# EAGLE design 6502exp (EAGLE 6.6.0)
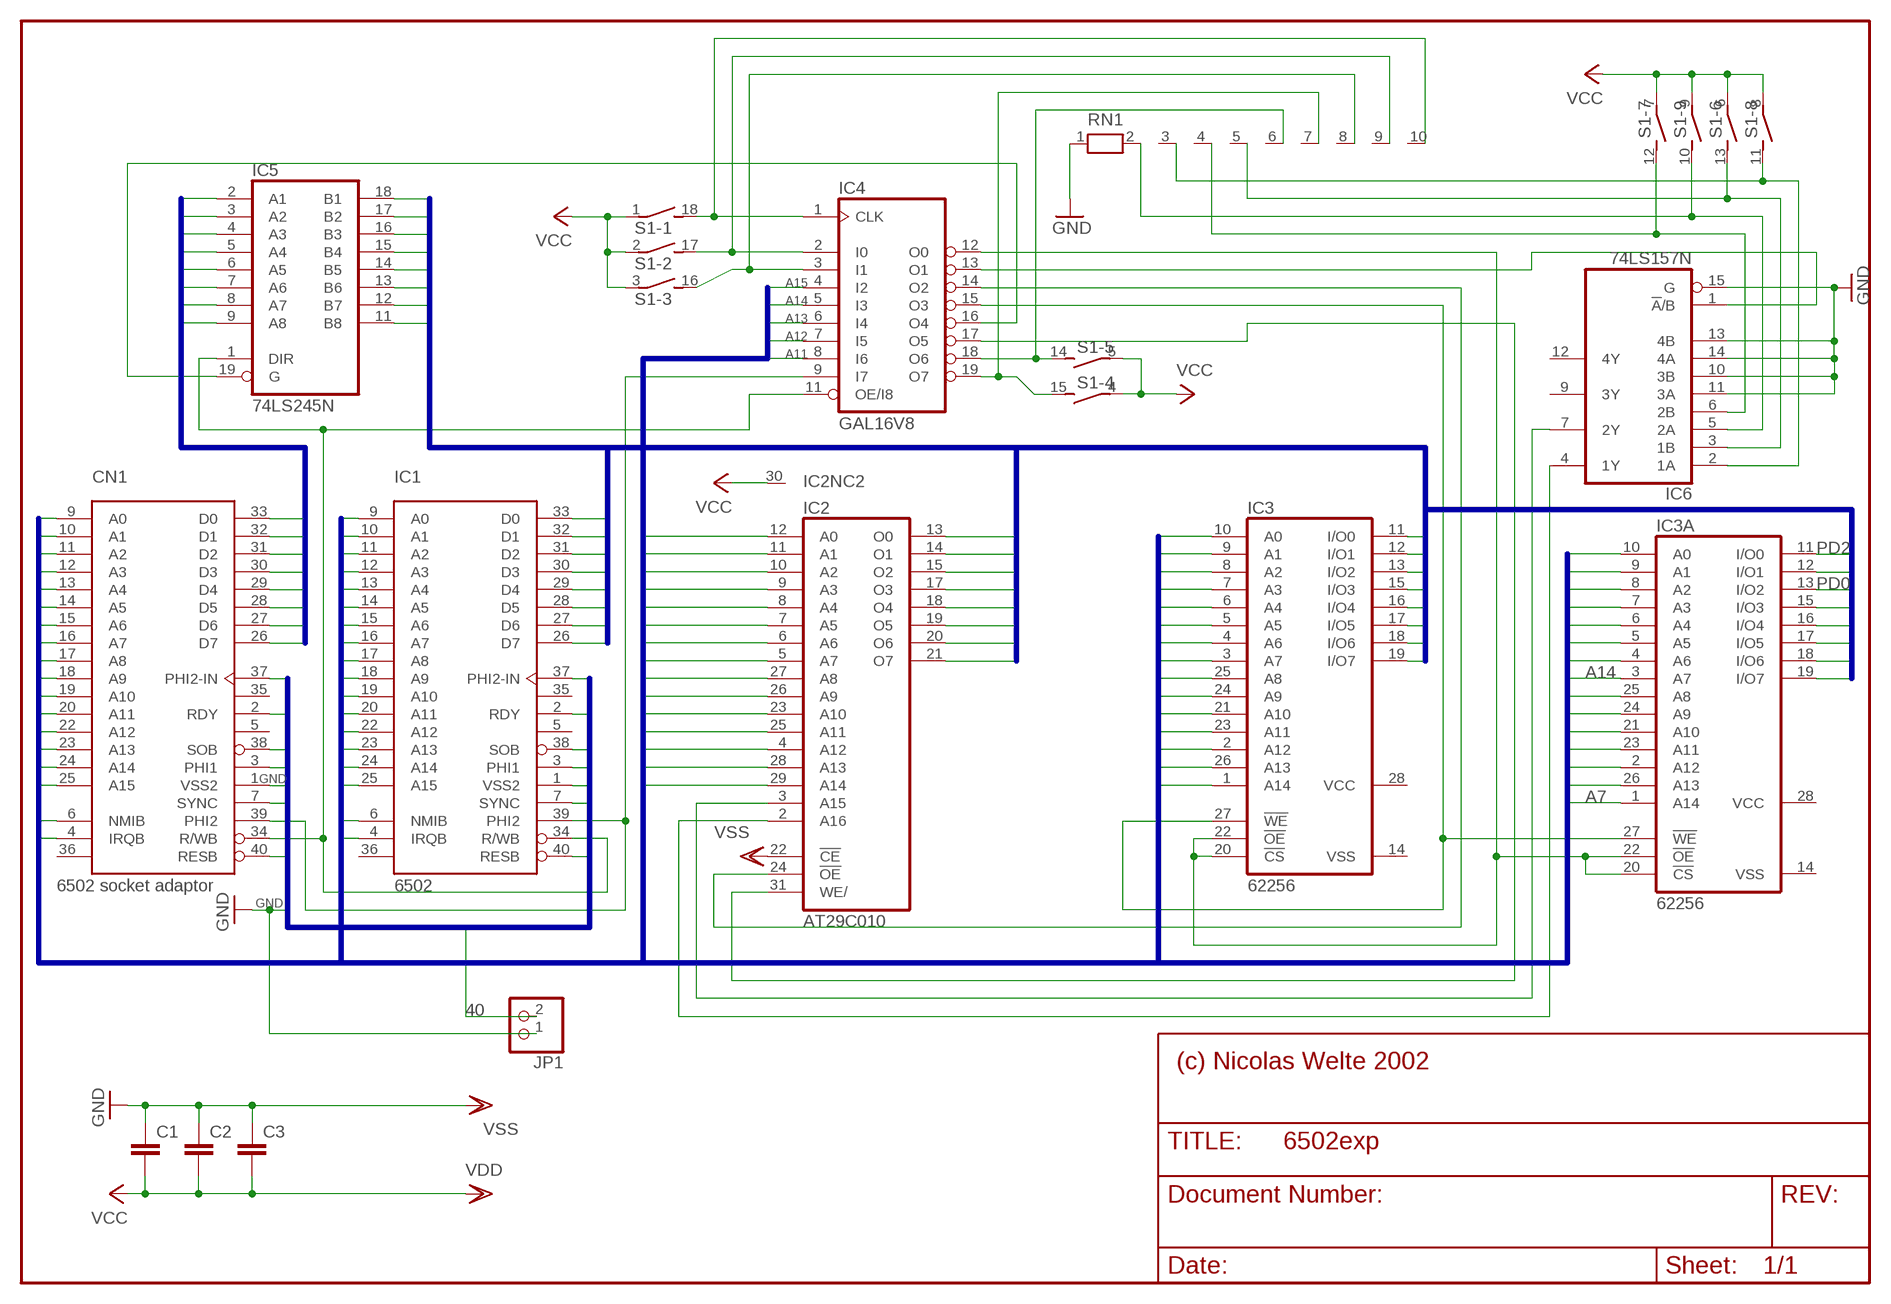
[diagram p0: schematic, sheet 1]

## Parts
C1  C5/3  [C5B3]
C2  C5/3  [C5B3]
C3  C5/3  [C5B3]
CN1  6502 socket adaptor  G65SC02P  [DIP-40]
IC1  6502  G65SC02P  [DIP-40]
IC2  AT29C010  AM29F010P  [DIL32-3]
IC3  62256  62256P  [DIL28-6]
IC3A  62256  62256FP  [SO28L]
IC4  GAL16V8  16V8  [DIL20]
IC5  74LS245N  [DIL20]
IC6  74LS157N  [DIL16]
JP1  PINHD-1X2  [1X02]
RN1  RN09  [RN-10]
S1  DS09E  [DS-09]

## Nets
2: CN1.2(RDY) IC1.2(RDY)
3: CN1.3(PHI1) IC1.3(PHI1)
7: CN1.7(SYNC) IC1.7(SYNC)
37: CN1.37(PHI2-IN) IC1.37(PHI2-IN)
38: CN1.38(SOB) IC1.38(SOB)
40: CN1.40(RESB) IC1.40(RESB) JP1.2
A0: CN1.9(A0) IC1.9(A0) IC2.12(A0) IC3.10(A0) IC3A.10(A0)
A1: CN1.10(A1) IC1.10(A1) IC2.11(A1) IC3.9(A1) IC3A.9(A1)
A2: CN1.11(A2) IC1.11(A2) IC2.10(A2) IC3.8(A2) IC3A.8(A2)
A3: CN1.12(A3) IC1.12(A3) IC2.9(A3) IC3.7(A3) IC3A.7(A3)
A4: CN1.13(A4) IC1.13(A4) IC2.8(A4) IC3.6(A4) IC3A.6(A4)
A5: CN1.14(A5) IC1.14(A5) IC2.7(A5) IC3.5(A5) IC3A.5(A5)
A6: CN1.15(A6) IC1.15(A6) IC2.6(A6) IC3.4(A6) IC3A.4(A6)
A7: CN1.16(A7) IC1.16(A7) IC2.5(A7) IC3.3(A7) IC3A.1(A14)
A8: CN1.17(A8) IC1.17(A8) IC2.27(A8) IC3.25(A8) IC3A.25(A8)
A9: CN1.18(A9) IC1.18(A9) IC2.26(A9) IC3.24(A9) IC3A.24(A9)
A10: CN1.19(A10) IC1.19(A10) IC2.23(A10) IC3.21(A10) IC3A.21(A10)
A11: CN1.20(A11) IC1.20(A11) IC2.25(A11) IC3.23(A11) IC3A.23(A11) IC4.8(I6)
A12: CN1.22(A12) IC1.22(A12) IC2.4(A12) IC3.2(A12) IC3A.2(A12) IC4.7(I5)
A13: CN1.23(A13) IC1.23(A13) IC2.28(A13) IC3.26(A13) IC3A.26(A13) IC4.6(I4)
A14: CN1.24(A14) IC1.24(A14) IC2.29(A14) IC3.1(A14) IC3A.3(A7) IC4.5(I3)
A15: CN1.25(A15) IC1.25(A15) IC4.4(I2)
D0: CN1.33(D0) IC5.2(A1)
D1: CN1.32(D1) IC5.3(A2)
D2: CN1.31(D2) IC5.4(A3)
D3: CN1.30(D3) IC5.5(A4)
D4: CN1.29(D4) IC5.6(A5)
D5: CN1.28(D5) IC5.7(A6)
D6: CN1.27(D6) IC5.8(A7)
D7: CN1.26(D7) IC5.9(A8)
GND: C1.1 C2.1 C3.1 CN1.1(VSS2) IC1.1(VSS2) IC2.22(!CE) IC6.10(3B) IC6.11(3A) IC6.13(4B) IC6.14(4A) IC6.15(G) JP1.1 RN1.1 ; supply symbol labelled VSS
IRQ: CN1.4(IRQB) IC1.4(IRQB)
N$1: CN1.34(R/WB) IC1.34(R/WB) IC4.11(OE/I8) IC5.1(DIR)
N$2: IC4.3(I1) RN1.8 S1.16
N$3: CN1.39(PHI2) IC1.39(PHI2) IC4.9(I7)
N$4: IC4.2(I0) RN1.9 S1.17
N$5: IC4.1(CLK) RN1.10 S1.18
N$6: IC4.18(O6) RN1.6 S1.14
N$7: IC4.19(O7) RN1.7 S1.15
N$8: IC4.16(O4) IC5.19(G)
N$9: IC3.27(!WE) IC3A.27(!WE) IC4.15(O3)
N$10: IC2.24(!OE) IC4.14(O2)
N$11: IC2.31(WE/) IC4.17(O5)
N$12: IC4.13(O1) IC6.1(!A!/B)
N$13: IC2.3(A15) IC6.7(2Y)
N$14: IC3.20(!CS) IC3.22(!OE) IC3A.20(!CS) IC3A.22(!OE) IC4.12(O0)
N$15: IC2.2(A16) IC6.4(1Y)
N$16: IC6.2(1A) RN1.3 S1.11
N$17: IC6.3(1B) RN1.5 S1.13
N$18: IC6.5(2A) RN1.2 S1.10
N$19: IC6.6(2B) RN1.4 S1.12
NMI: CN1.6(NMIB) IC1.6(NMIB)
PD0: IC1.33(D0) IC2.13(O0) IC3.11(I/O0) IC3A.13(I/O2) IC5.18(B1)
PD1: IC1.32(D1) IC2.14(O1) IC3.12(I/O1) IC3A.12(I/O1) IC5.17(B2)
PD2: IC1.31(D2) IC2.15(O2) IC3.13(I/O2) IC3A.11(I/O0) IC5.16(B3)
PD3: IC1.30(D3) IC2.17(O3) IC3.15(I/O3) IC3A.15(I/O3) IC5.15(B4)
PD4: IC1.29(D4) IC2.18(O4) IC3.16(I/O4) IC3A.16(I/O4) IC5.14(B5)
PD5: IC1.28(D5) IC2.19(O5) IC3.17(I/O5) IC3A.17(I/O5) IC5.13(B6)
PD6: IC1.27(D6) IC2.20(O6) IC3.18(I/O6) IC3A.18(I/O6) IC5.12(B7)
PD7: IC1.26(D7) IC2.21(O7) IC3.19(I/O7) IC3A.19(I/O7) IC5.11(B8)
VCC: C1.2 C2.2 C3.2 IC2.30(NC) S1.1 S1.2 S1.3 S1.4 S1.5 S1.6 S1.7 S1.8 S1.9 ; supply symbol labelled VDD
Unconnected: CN1.5(NC$3) CN1.35(NC$1) CN1.36(NC$2) IC1.5(NC$3) IC1.35(NC$1) IC1.36(NC$2) IC2.1(NC) IC6.9(3Y) IC6.12(4Y)

## Buses
D[0..7]
PD[0..7]
A[0..15],NMI,IRQ
37,2,38,3,1,7,40

## Notes on the sheet
- (c) Nicolas Welte 2002

## Power pins joined to a net without a drawn wire
GND: CN1.21(VSS) IC1.21(VSS) IC2.16(GND) IC3.14(VSS) IC3A.14(VSS) IC4.10(GND) IC5.10(GND) IC6.8(GND)
VCC: CN1.8(VDD) IC1.8(VDD) IC2.32(VCC) IC3.28(VCC) IC3A.28(VCC) IC4.20(VCC) IC5.20(VCC) IC6.16(VCC)

## Library data of the parts
C1-C3 = capacitor-wima:C: CAPACITOR naming: grid - package width
CN1 IC1 = 65XXX:G65SC02P
IC2 = am29-memory:AM29F010*: 1-Megabit FLASH MEMORY (128 K x 8 bit) 5 V-only
IC3 = memory-hitachi:62256P: MEMORY
IC3A = memory-hitachi:62256FP: MEMORY
IC4 = pal:16V8: PAL
IC5 = 74xx-eu:74*245: Octal BUS TRANSCEIVER, 3-state
IC6 = 74xx-eu:74*157: Quadruple 2-line to 1-line data SELECTOR/MULTIPLEXER
JP1 = pinhead:PINHD-1X2: PIN HEADER
RN1 = resistor-net:RN09: RESISTOR NETWORK
S1 = switch-dil:DS09E: DIL/CODE SWITCH

## Board
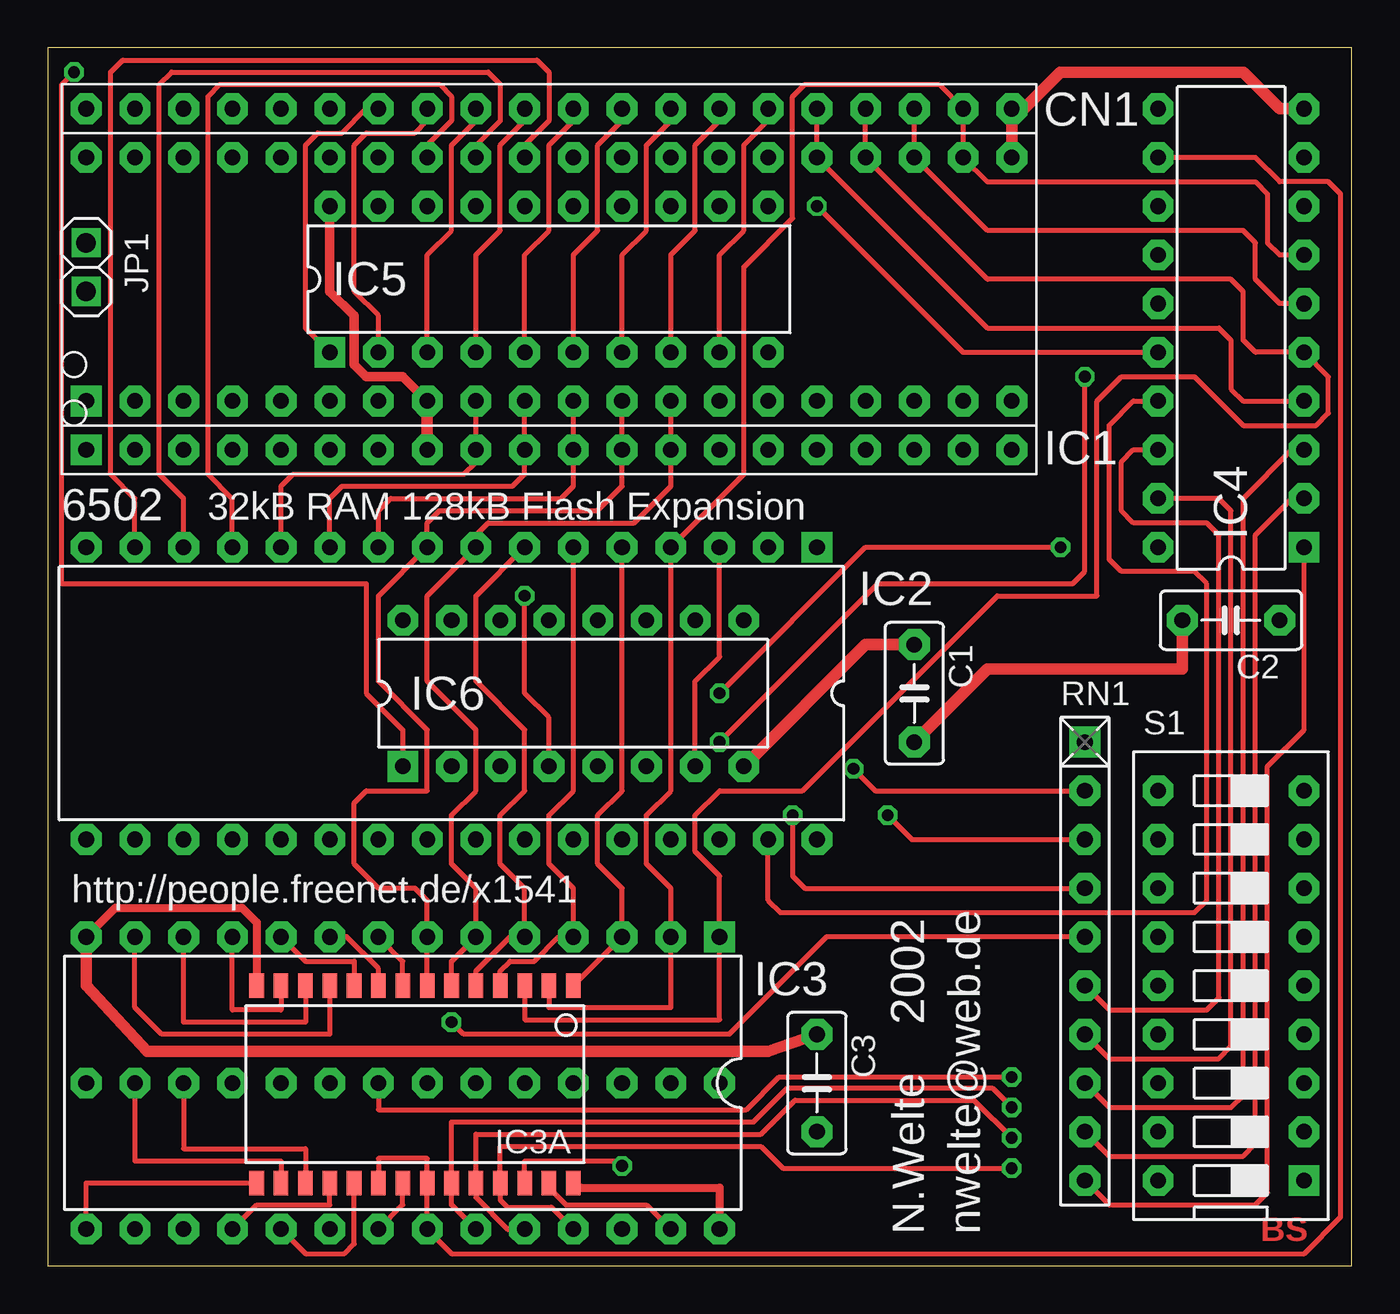
[diagram p1: board, top side]
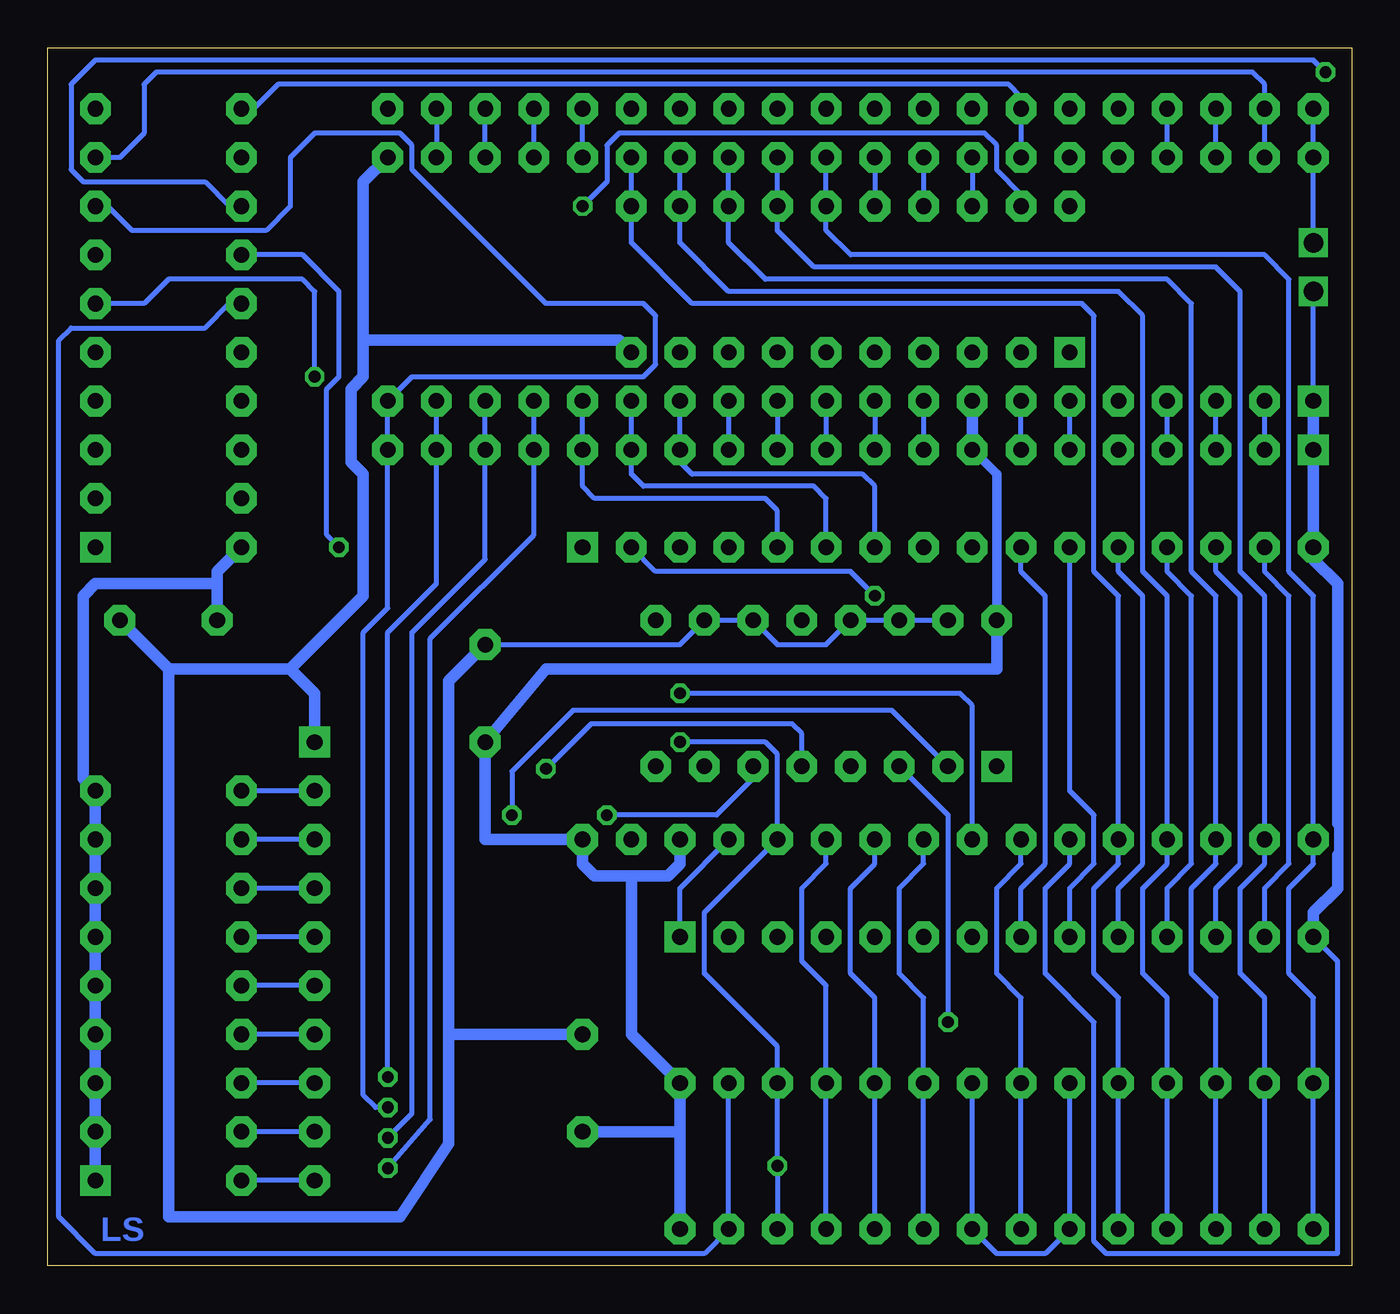
[diagram p2: board, bottom side, seen from below]

Size 67.97 x 63.49 mm. Coordinates in mm from the lower left corner, seen from the top.
Outline: 0,0 67.97,0 67.97,63.49 0,63.49 0,0
Copper layers (1*16): Top 0.035mm / dielectric 1.5mm / Bottom 0.035mm
Design rules "default *": minimum track width 10mil, minimum drill 24mil, track to track 8mil, track to pad 8mil, pad to pad 8mil, via to via 8mil, smd to smd 8mil, copper to edge 0.4mm, drill to drill 8mil, minimum pad ring 10mil, minimum via ring 8mil, stop-mask expansion 4mil, vias tented up to drill 0mil, thermal gap 10mil

### Footprints (pad centres in the part's own frame; a part is rotated, then mirrored left to right if it is on the bottom)
C5B3 = drill 0.813 pad 1.6 octagon: 1 -2.54,0; 2 2.54,0
DIP-40 = drill 0.813 pad 1.6 square: 1 -22.86,-7.62 | drill 0.813 pad 1.6 octagon: 2 -20.32,-7.62; 3 -17.78,-7.62; 4 -15.24,-7.62; 5 -12.7,-7.62; 6 -10.16,-7.62; 7 -7.62,-7.62; 8 -5.08,-7.62; 9 -2.54,-7.62; 10 0,-7.62; 11 2.54,-7.62; 12 5.08,-7.62; 13 7.62,-7.62; 14 10.16,-7.62; 15 12.7,-7.62; 16 15.24,-7.62; 17 17.78,-7.62; 18 20.32,-7.62; 19 22.86,-7.62; 20 25.4,-7.62; 21 25.4,7.62; 22 22.86,7.62; 23 20.32,7.62; 24 17.78,7.62; 25 15.24,7.62; 26 12.7,7.62; 27 10.16,7.62; 28 7.62,7.62; 29 5.08,7.62; 30 2.54,7.62; 31 0,7.62; 32 -2.54,7.62; 33 -5.08,7.62; 34 -7.62,7.62; 35 -10.16,7.62; 36 -12.7,7.62; 37 -15.24,7.62; 38 -17.78,7.62; 39 -20.32,7.62; 40 -22.86,7.62
DIL32-3 = drill 0.813 pad 1.6 square: 1 -19.05,-3.81 | drill 0.813 pad 1.6 octagon: 2 -16.51,-3.81; 3 -13.97,-3.81; 4 -11.43,-3.81; 5 -8.89,-3.81; 6 -6.35,-3.81; 7 -3.81,-3.81; 8 -1.27,-3.81; 9 1.27,-3.81; 10 3.81,-3.81; 11 6.35,-3.81; 12 8.89,-3.81; 13 11.43,-3.81; 14 13.97,-3.81; 15 16.51,-3.81; 16 19.05,-3.81; 17 19.05,11.43; 18 16.51,11.43; 19 13.97,11.43; 20 11.43,11.43; 21 8.89,11.43; 22 6.35,11.43; 23 3.81,11.43; 24 1.27,11.43; 25 -1.27,11.43; 26 -3.81,11.43; 27 -6.35,11.43; 28 -8.89,11.43; 29 -11.43,11.43; 30 -13.97,11.43; 31 -16.51,11.43; 32 -19.05,11.43
DIL28-6 = drill 0.813 pad 1.6 square: 1 -16.51,-7.62 | drill 0.813 pad 1.6 octagon: 2 -13.97,-7.62; 3 -11.43,-7.62; 4 -8.89,-7.62; 5 -6.35,-7.62; 6 -3.81,-7.62; 7 -1.27,-7.62; 8 1.27,-7.62; 9 3.81,-7.62; 10 6.35,-7.62; 11 8.89,-7.62; 12 11.43,-7.62; 13 13.97,-7.62; 14 16.51,-7.62; 15 16.51,7.62; 16 13.97,7.62; 17 11.43,7.62; 18 8.89,7.62; 19 6.35,7.62; 20 3.81,7.62; 21 1.27,7.62; 22 -1.27,7.62; 23 -3.81,7.62; 24 -6.35,7.62; 25 -8.89,7.62; 26 -11.43,7.62; 27 -13.97,7.62; 28 -16.51,7.62
SO28L = smd 0.762 x 1.27: 1 -7.62,-5.207; 2 -6.35,-5.207; 3 -5.08,-5.207; 4 -3.81,-5.207; 5 -2.54,-5.207; 6 -1.27,-5.207; 7 0,-5.207; 8 1.27,-5.207; 9 2.54,-5.207; 10 3.81,-5.207; 11 5.08,-5.207; 12 6.35,-5.207; 13 7.62,-5.207; 14 8.89,-5.207; 15 8.89,5.08; 16 7.62,5.08; 17 6.35,5.08; 18 5.08,5.08; 19 3.81,5.08; 20 2.54,5.08; 21 1.27,5.08; 22 0,5.08; 23 -1.27,5.08; 24 -2.54,5.08; 25 -3.81,5.08; 26 -5.08,5.08; 27 -6.35,5.08; 28 -7.62,5.08
DIL20 = drill 0.813 pad 1.6 square: 1 -11.43,-3.81 | drill 0.813 pad 1.6 octagon: 2 -8.89,-3.81; 3 -6.35,-3.81; 4 -3.81,-3.81; 5 -1.27,-3.81; 6 1.27,-3.81; 7 3.81,-3.81; 8 6.35,-3.81; 9 8.89,-3.81; 10 11.43,-3.81; 11 11.43,3.81; 12 8.89,3.81; 13 6.35,3.81; 14 3.81,3.81; 15 1.27,3.81; 16 -1.27,3.81; 17 -3.81,3.81; 18 -6.35,3.81; 19 -8.89,3.81; 20 -11.43,3.81
DIL16 = drill 0.813 pad 1.6 square: 1 -8.89,-3.81 | drill 0.813 pad 1.6 octagon: 2 -6.35,-3.81; 3 -3.81,-3.81; 4 -1.27,-3.81; 5 1.27,-3.81; 6 3.81,-3.81; 7 6.35,-3.81; 8 8.89,-3.81; 9 8.89,3.81; 10 6.35,3.81; 11 3.81,3.81; 12 1.27,3.81; 13 -1.27,3.81; 14 -3.81,3.81; 15 -6.35,3.81; 16 -8.89,3.81
1X02 = drill 1.016 square: 1 -1.27,0; 2 1.27,0
RN-10 = drill 0.813 pad 1.6 square: 1 -11.43,0 | drill 0.813 pad 1.6 octagon: 2 -8.89,0; 3 -6.35,0; 4 -3.81,0; 5 -1.27,0; 6 1.27,0; 7 3.81,0; 8 6.35,0; 9 8.89,0; 10 11.43,0
DS-09 = drill 0.813 pad 1.6 square: 1 -10.16,-3.81 | drill 0.813 pad 1.6 octagon: 2 -7.62,-3.81; 3 -5.08,-3.81; 4 -2.54,-3.81; 5 0,-3.81; 6 2.54,-3.81; 7 5.08,-3.81; 8 7.62,-3.81; 9 10.16,-3.81; 10 10.16,3.81; 11 7.62,3.81; 12 5.08,3.81; 13 2.54,3.81; 14 0,3.81; 15 -2.54,3.81; 16 -5.08,3.81; 17 -7.62,3.81; 18 -10.16,3.81

### Placement (x,y rotation side)
C1  45.17,29.84 270 top
C2  61.68,33.65 180 top
C3  40.09,9.52 270 top
CN1  24.85,52.7 0 top
IC1  24.85,50.16 0 top
IC2  21.04,33.65 180 top
IC3  18.5,9.52 180 top
IC3A  19.77,9.39 180 top
IC4  61.68,48.89 90 top
IC5  26.12,51.43 0 top
IC6  27.39,29.84 0 top
JP1  1.99,52.06 90 top
RN1  54.06,15.87 270 top
S1  61.68,14.6 90 top

### Tracks (layer width: path | path; a pad name or v marks a point on that pad's centre or on a via)
2
  Bottom 0.254: IC1.2 CN1.2
3
  Bottom 0.254: IC1.3 CN1.3
7
  Bottom 0.254: IC1.7 CN1.7
37
  Bottom 0.254: IC1.37 CN1.37
38
  Bottom 0.254: IC1.38 CN1.38
40
  Bottom 0.254: CN1.40 IC1.40 JP1.2
A0
  Top 0.254: IC2.12 12.15,40.63 12.79,41.27 21.68,41.27 22.31,41.9 CN1.9 | IC3A.10 15.96,15.87 13.42,15.87 IC3.10
  Bottom 0.254: IC2.12 12.15,36.19 10.88,34.92 10.88,20.95 12.15,19.68 IC3.10 | CN1.9 IC1.9
A1
  Top 0.254: IC2.11 14.69,40 15.33,40.63 24.22,40.63 24.85,41.27 CN1.10 | IC3A.9 17.23,15.49 15.58,17.14 IC3.9
  Bottom 0.254: IC3.9 14.69,19.68 13.42,20.95 13.42,23.49 14.69,24.76 IC2.11 | CN1.10 IC1.10
A2
  Top 0.254: IC2.10 17.23,39.36 17.87,40 26.76,40 27.39,40.63 CN1.11 | IC3A.8 18.5,15.87 IC3.8
  Bottom 0.254: IC3.8 17.23,19.68 15.96,20.95 15.96,34.92 17.23,36.19 IC2.10 | CN1.11 IC1.11
A3
  Top 0.254: CN1.12 29.93,40.63 28.66,39.36 20.41,39.36 19.77,38.73 IC2.9 17.23,34.92 17.23,30.48 19.77,27.94 19.77,24.76 16.6,24.76 15.96,24.12 15.96,20.95 17.23,19.68 19.14,19.68 19.77,19.05 IC3.7 IC3A.7
  Bottom 0.254: CN1.12 IC1.12
A4
  Top 0.254: CN1.13 32.47,40.63 30.57,38.73 22.95,38.73 22.31,38.09 IC2.8 19.77,34.92 19.77,30.48 22.31,27.94 22.31,24.76 21.04,23.49 21.04,20.95 22.31,19.68 IC3.6 21.04,15.87 IC3A.6
  Bottom 0.254: CN1.13 IC1.13
A5
  Top 0.254: IC2.7 22.31,34.92 22.31,30.48 24.85,27.94 24.85,24.76 23.58,23.49 23.58,20.95 24.85,19.68 IC3.5 24.09,17.14 22.31,15.36 IC3A.5
  Bottom 0.254: IC2.7 24.85,40.63 25.49,41.27 34.38,41.27 35.01,41.9 IC1.14 CN1.14
A6
  Top 0.254: IC2.6 27.39,24.76 26.12,23.49 26.12,20.95 27.39,19.68 IC3.4 26.63,17.14 25.36,15.87 24.09,15.87 23.58,15.36 IC3A.4
  Bottom 0.254: IC2.6 27.39,40 28.03,40.63 36.92,40.63 37.55,41.27 IC1.15 CN1.15
A7
  Top 0.254: IC2.5 29.93,24.76 28.66,23.49 28.66,20.95 29.93,19.68 IC3.3 IC3A.1
  Bottom 0.254: IC2.5 29.93,39.36 30.57,40 39.46,40 40.09,40.63 IC1.16 CN1.16
A8  (via drill 0.61, 0.81 pad 1.6)
  Top 0.254: v50.25,5.08 38.32,5.08 37.17,6.22 23.58,6.22 IC3A.25 23.58,3.42 23.96,3.04 26.25,3.04 IC3.25
  Bottom 0.254: IC3.25 v27.39,9.52 27.39,14.6 28.66,15.87 28.66,19.68 27.39,20.95 IC2.27 | CN1.17 IC1.17 42.63,38.09 48.03,32.7 48.03,7.62 v50.25,5.08
A9  (via drill 0.61, 0.81 pad 1.6)
  Top 0.254: v50.25,6.66 48.29,8.63 38.95,8.63 37.17,6.85 22.31,6.85 IC3A.24 22.31,3.55 23.96,1.9 IC3.24 24.98,1.9
  Bottom 0.254: IC3.24 v24.85,9.52 24.85,13.96 26.12,15.23 26.12,19.68 24.85,20.95 IC2.26 | CN1.18 IC1.18 45.17,36.82 48.98,33.02 48.98,7.93 v50.25,6.66
A10  (via drill 0.61, 0.81 pad 1.6)
  Top 0.254: v50.25,9.84 38.12,9.84 36.41,8.12 17.23,8.12 v17.23,9.52 | IC3.21 18.5,3.17 IC3A.21
  Bottom 0.254: IC2.23 17.23,20.95 18.5,19.68 18.5,15.23 17.23,13.96 v17.23,9.52 IC3.21 | CN1.19 IC1.19 47.71,35.55 50.25,33.02 v50.25,9.84
A11  (via drill 0.61, 0.81 pad 1.6)
  Top 0.254: v50.25,8.25 49.24,9.27 38.57,9.27 36.79,7.49 21.04,7.49 21.04,4.19 | IC3.23 21.04,3.17 21.04,4.19 | 21.04,4.19 IC3A.23
  Bottom 0.254: IC2.25 22.31,20.95 23.58,19.68 23.58,15.23 22.31,13.96 v22.31,9.52 IC3.23 | IC4.8 64.86,55.24 63.59,53.97 56.6,53.97 55.33,55.24 55.33,57.78 54.06,59.05 49.62,59.05 48.98,58.41 48.98,57.14 42,50.16 36.92,50.16 36.28,49.52 36.28,46.98 36.92,46.35 48.98,46.35 CN1.20 IC1.20 50.25,34.28 51.52,33.02 51.52,8.88 50.89,8.25 v50.25,8.25
A12
  Top 0.254: IC4.7 64.22,52.7 63.59,53.34 63.59,55.88 62.95,56.51 48.98,56.51 IC1.22 CN1.22 46.44,61.59 39.46,61.59 38.82,60.95 38.82,54.6 36.28,52.06 36.28,41.27 IC2.4 32.47,24.76 31.2,23.49 31.2,20.95 32.47,19.68 IC3.2 32.47,13.46 26.12,13.46 IC3A.2
  Bottom 0.254: CN1.22 IC1.22
A13  (via drill 0.61, 0.81 pad 1.6)
  Top 0.254: v35.01,27.3 43.27,35.55 53.43,35.55 54.06,36.19 v54.06,46.35 | IC4.6 64.22,50.16 62.95,51.43 62.95,53.34 62.32,53.97 48.98,53.97 IC1.23 CN1.23 | v29.93,5.2 29.93,5.46 24.85,5.46 IC3A.26
  Bottom 0.254: IC1.23 CN1.23 | v35.01,27.3 30.57,27.3 29.93,26.67 IC2.28 33.74,18.41 33.74,15.23 29.93,11.42 v29.93,9.52 v29.93,5.2 IC3.26 | v54.06,46.35 54.06,50.79 54.7,51.43 61.68,51.43 62.95,50.16 IC4.6
A14
  Top 0.254: CN1.24 IC1.24 48.98,51.43 61.68,51.43 62.32,50.79 62.32,48.25 62.95,47.62 IC4.5 66.76,46.35 66.76,44.45 66.13,43.81 62.32,43.81 59.78,46.35 55.97,46.35 54.7,45.08 54.7,34.92 49.49,34.92 39.33,24.76 35.01,24.76 33.74,23.49 33.74,21.59 35.01,20.32 IC3.1 35.01,12.82 24.85,12.82 IC3A.3
  Bottom 0.254: IC1.24 CN1.24 | IC3.1 35.01,19.68 IC2.29
A15
  Top 0.254: IC4.4 62.32,45.08 61.68,45.71 61.68,48.25 61.05,48.89 48.98,48.89 IC1.25 CN1.25
  Bottom 0.254: IC1.25 CN1.25
D0
  Top 0.254: CN1.33 19.77,59.68 19.14,59.05 16.6,59.05 15.96,58.41 15.96,50.79 17.23,49.52 IC5.2
D1
  Top 0.254: IC5.3 19.77,52.7 21.04,53.97 21.04,58.41 22.31,59.68 CN1.32
D2
  Top 0.254: IC5.4 22.31,52.7 23.58,53.97 23.58,58.41 24.85,59.68 CN1.31
D3
  Top 0.254: IC5.5 24.85,52.7 26.12,53.97 26.12,58.41 27.39,59.68 CN1.30
D4
  Top 0.254: IC5.6 27.39,52.7 28.66,53.97 28.66,58.41 29.93,59.68 CN1.29
D5
  Top 0.254: IC5.7 29.93,52.7 31.2,53.97 31.2,58.41 32.47,59.68 CN1.28
D6
  Top 0.254: IC5.8 32.47,52.7 33.74,53.97 33.74,58.41 35.01,59.68 CN1.27
D7
  Top 0.254: IC5.9 35.01,52.7 36.28,53.97 36.28,58.41 37.55,59.68 CN1.26
GND
  Top 0.406: IC3A.14 10.88,17.9 10.12,18.66 3.52,18.66 IC3.14
  Top 0.61: IC4.10 64.22,60.32 62.32,62.22 52.79,62.22 50.89,60.32 CN1.21 IC1.21 | IC6.8 42.63,32.38 C1.1 | IC3.14 1.99,14.6 5.17,11.17 37.55,11.17 C3.1
  Bottom 0.254: IC6.15 IC6.14 IC6.13 27.39,32.38 29.93,32.38 IC6.11 IC6.10 35.01,32.38 C1.1 | IC2.22 14.69,20.95 15.96,19.68 15.96,15.23 13.42,12.69 13.42,1.27 12.79,0.63 0.72,0.63 0.72,15.87 IC3.14 | CN1.1 JP1.1
  Bottom 0.406: 0.72,21.41 0.67,21.41 | 0.67,23.49 0.72,23.06 | 1.99,36.82 IC2.16
  Bottom 0.508: 0.67,21.41 0.67,23.49
  Bottom 0.61: 51.52,48.25 38.19,48.25 IC5.10 | 51.52,48.25 51.52,56.51 IC1.21 | 0.72,21.41 0.72,19.68 1.99,18.41 IC3.14 | 0.72,23.06 0.72,35.55 1.99,36.82 | CN1.1 IC1.1 IC2.16 | C1.1 47.08,30.48 47.08,12.06 | 47.08,12.06 47.08,6.34 49.62,2.54 61.68,2.54 61.68,31.11 | C3.1 47.08,12.06 | 51.52,48.25 51.52,46.35 52.16,45.71 52.16,41.9 51.52,41.27 51.52,34.92 55.33,31.11 | 61.68,31.11 55.33,31.11 | 61.68,31.11 C2.1 | RN1.1 54.06,29.84 55.33,31.11
IRQ
  Bottom 0.254: IC1.4 CN1.4
N$1
  Top 0.254: IC5.1 13.42,48.89 13.42,58.41 14.06,59.05 15.33,59.05 16.6,60.32 CN1.34
  Bottom 0.254: IC4.11 57.24,60.32 55.97,61.59 17.87,61.59 17.23,60.95 CN1.34 IC1.34
N$2
  Top 0.254: IC4.3 64.86,42.54 62.32,40 62.32,8.88 61.68,8.25 55.33,8.25 RN1.8
  Bottom 0.254: RN1.8 S1.16
N$3
  Bottom 0.254: IC1.39 CN1.39 4.53,61.59 5.17,62.22 62.32,62.22 62.95,61.59 62.95,59.05 64.22,57.78 IC4.9
N$4
  Top 0.254: IC4.2 64.86,40 62.95,38.09 62.95,6.34 62.32,5.71 55.33,5.71 RN1.9
  Bottom 0.254: RN1.9 S1.17
N$5
  Top 0.254: IC4.1 65.49,27.94 63.59,26.03 63.59,3.81 62.95,3.17 55.33,3.17 RN1.10
  Bottom 0.254: RN1.10 S1.18
N$6
  Top 0.254: IC4.18 56.6,42.54 55.97,41.9 55.97,39.36 56.6,38.73 60.41,38.73 61.05,38.09 61.05,13.96 60.41,13.33 55.33,13.33 RN1.6
  Bottom 0.254: RN1.6 S1.14
N$7
  Top 0.254: IC4.19 61.05,40 61.68,39.36 61.68,11.42 61.05,10.79 55.33,10.79 RN1.7
  Bottom 0.254: RN1.7 S1.15
N$8  (via drill 0.61)
  Top 0.254: v40.09,55.24 47.71,47.62 IC4.16
  Bottom 0.254: v40.09,55.24 38.82,56.51 38.82,58.41 38.19,59.05 19.14,59.05 18.5,58.41 18.5,57.14 17.23,55.88 IC5.19
N$9  (via drill 0.81 pad 1.6)
  Top 0.254: IC3A.27 26.12,4.06 27.01,3.17 31.2,3.17 IC3.27
  Bottom 0.254: IC4.15 58.51,50.16 59.78,48.89 66.76,48.89 67.4,48.25 67.4,2.54 65.49,0.63 33.74,0.63 IC3.27 v32.47,9.52
N$10  (via drill 0.61)
  Top 0.254: v52.79,37.46 42.63,37.46 v35.01,29.84
  Bottom 0.254: IC4.14 54.7,52.7 52.79,50.79 52.79,46.35 53.43,45.71 53.43,38.09 v52.79,37.46 | v35.01,29.84 20.41,29.84 19.77,29.21 IC2.24
N$11
  Top 0.254: IC4.17 56.6,45.08 55.33,43.81 55.33,36.82 55.97,36.19 59.78,36.19 60.41,35.55 60.41,19.05 59.78,18.41 38.19,18.41 37.55,19.05 IC2.31
N$12  (via drill 0.61)
  Top 0.254: IC6.1 18.5,27.94 16.6,29.84 16.6,35.55 0.72,35.55 0.72,61.59 v1.36,62.22
  Bottom 0.254: v1.36,62.22 1.99,62.86 65.49,62.86 66.76,61.59 66.76,57.14 66.13,56.51 59.78,56.51 58.51,55.24 IC4.13
N$13
  Top 0.254: IC6.7 33.74,30.48 35.01,31.75 IC2.3
N$14  (via drill 0.81 pad 1.6)
  Top 0.254: IC4.12 62.95,57.78 64.22,56.51 66.76,56.51 67.4,55.88 67.4,2.54 65.49,0.63 21.04,0.63 IC3.22 IC3A.22 19.77,5.58 17.23,5.58 IC3A.20 17.11,4.31
  Bottom 0.254: v19.77,9.52 IC3.22 18.5,0.63 15.96,0.63 IC3.20 | IC3.20 v14.69,9.52 IC3.20
N$15  (via drill 0.61)
  Top 0.254: IC6.4 26.12,28.57 24.85,29.84 v24.85,34.92
  Bottom 0.254: v24.85,34.92 26.12,36.19 36.28,36.19 IC2.2
N$16  (via drill 0.61)
  Top 0.254: RN1.3 45.05,22.22 v43.78,23.49
  Bottom 0.254: RN1.3 S1.11 | IC6.2 23.96,28.95 40.6,28.95 43.78,25.78 v43.78,23.49
N$17  (via drill 0.61)
  Top 0.254: RN1.5 40.6,17.14 35.52,12.06 21.68,12.06 v21.04,12.69
  Bottom 0.254: RN1.5 S1.13 | IC6.3 21.04,23.49 v21.04,12.69
N$18  (via drill 0.61)
  Top 0.254: v42,25.9 43.14,24.76 RN1.2
  Bottom 0.254: RN1.2 S1.10 | IC6.5 28.66,27.75 29.17,28.25 39.65,28.25 v42,25.9
N$19  (via drill 0.61)
  Top 0.254: RN1.4 39.46,19.68 38.82,20.32 v38.82,23.49
  Bottom 0.254: v38.82,23.49 33.11,23.49 31.2,25.39 IC6.6 | RN1.4 S1.12
NMI
  Bottom 0.254: IC1.6 CN1.6
PD0
  Top 0.254: IC2.13 9.61,40 8.34,41.27 8.34,60.95 8.98,61.59 20.41,61.59 21.04,60.95 21.04,59.68 19.77,58.41 IC1.33 | IC3A.13 12.15,13.33 9.61,13.33 IC3.11
  Bottom 0.254: IC2.13 9.61,36.19 8.34,34.92 8.34,20.95 9.61,19.68 IC3.11 | IC1.33 IC5.18
PD1
  Top 0.254: IC2.14 7.07,40 5.8,41.27 5.8,61.59 6.44,62.22 22.95,62.22 23.58,61.59 23.58,59.68 22.31,58.41 IC1.32 | IC3A.12 13.42,12.69 7.07,12.69 IC3.12
  Bottom 0.254: IC2.14 7.07,36.19 5.8,34.92 5.8,20.95 7.07,19.68 IC3.12 | IC1.32 IC5.17
PD2
  Top 0.254: IC2.15 4.53,40 3.26,41.27 3.26,62.22 3.9,62.86 25.49,62.86 26.12,62.22 26.12,59.68 24.85,58.41 IC1.31 | IC3A.11 14.69,12.06 5.93,12.06 4.53,13.46 IC3.13
  Bottom 0.254: IC2.15 4.53,36.19 3.26,34.92 3.26,20.95 4.53,19.68 IC3.13 | IC1.31 IC5.16
PD3  (via drill 0.81 pad 1.6)
  Top 0.254: IC3A.15 1.99,4.31 IC3.15
  Bottom 0.254: IC3.15 v1.99,9.52 1.99,13.96 3.26,15.23 3.26,19.68 1.99,20.95 IC2.17 1.99,34.92 3.26,36.19 3.26,51.43 4.53,52.7 26.12,52.7 27.39,53.97 IC5.15 IC1.30
PD4  (via drill 0.81 pad 1.6)
  Top 0.254: IC3A.16 12.15,5.46 4.53,5.46 v4.53,9.52
  Bottom 0.254: IC3.16 v4.53,9.52 4.53,13.96 5.8,15.23 5.8,19.68 4.53,20.95 IC2.18 4.53,34.92 5.8,36.19 5.8,50.79 7.07,52.06 28.03,52.06 29.93,53.97 IC5.14 IC1.29
PD5  (via drill 0.81 pad 1.6)
  Top 0.254: IC3A.17 13.42,6.09 7.07,6.09 v7.07,9.52
  Bottom 0.254: IC3.17 v7.07,9.52 7.07,13.96 8.34,15.23 8.34,19.68 7.07,20.95 IC2.19 7.07,34.92 8.34,36.19 8.34,50.16 9.61,51.43 30.57,51.43 32.47,53.34 IC5.13 IC1.28
PD6  (via drill 0.81 pad 1.6)
  Top 0.254: IC3A.18 14.69,3.17 10.88,3.17 IC3.18
  Bottom 0.254: IC3.18 v9.61,9.52 9.61,13.96 10.88,15.23 10.88,19.68 9.61,20.95 IC2.20 9.61,34.92 10.88,36.19 10.88,49.52 12.15,50.79 32.47,50.79 35.01,53.34 IC5.12 IC1.27
PD7  (via drill 0.81 pad 1.6)
  Top 0.254: IC3A.19 15.96,1.14 15.46,0.63 13.42,0.63 IC3.19
  Bottom 0.254: IC3.19 v12.15,9.52 12.15,13.96 13.42,15.23 13.42,19.68 12.15,20.95 IC2.21 12.15,34.92 13.42,36.19 13.42,49.52 14.06,50.16 34.38,50.16 37.55,53.34 IC5.11 IC1.26
VCC  (via drill 0.81 pad 1.6)
  Top 0.254: IC3A.28 27.77,4.06
  Top 0.406: 27.77,4.06 35.01,4.06 IC3.28
  Top 0.508: IC5.20 14.69,50.79 15.96,49.52 15.96,46.98 16.6,46.35 18.5,46.35 CN1.8
  Top 0.61: C2.2 59.14,31.11 48.98,31.11 C1.2 | IC1.8 CN1.8
  Bottom 0.254: 45.17,26.67 C1.2
  Bottom 0.508: IC6.16 18.5,41.27 IC1.8
  Bottom 0.61: IC4.20 59.14,36.19 59.14,35.55 | C2.2 59.14,35.55 | 45.17,26.67 45.17,22.22 IC2.32 40.09,20.95 39.46,20.32 37.55,20.32 | IC6.16 18.5,31.11 42,31.11 C1.2 | IC1.8 CN1.8 | IC2.30 35.01,20.95 35.65,20.32 37.55,20.32 | IC3.28 35.01,6.98 | 35.01,6.98 v35.01,9.52 37.55,12.06 37.55,20.32 | 35.01,6.98 C3.2 | S1.1 S1.2 S1.3 S1.4 S1.5 S1.6 S1.7 S1.8 S1.9 66.13,25.39 66.13,34.92 65.49,35.55 59.14,35.55

### Text on the board
Top: BS
Bottom: LS
tNames: 6502 | 32kB RAM 128kB Flash Expansion | http://people.freenet.de/x1541 | 2002 | N.Welte | nwelte@web.de